# EAGLE schematic Blinky (EAGLE 9.6.2)
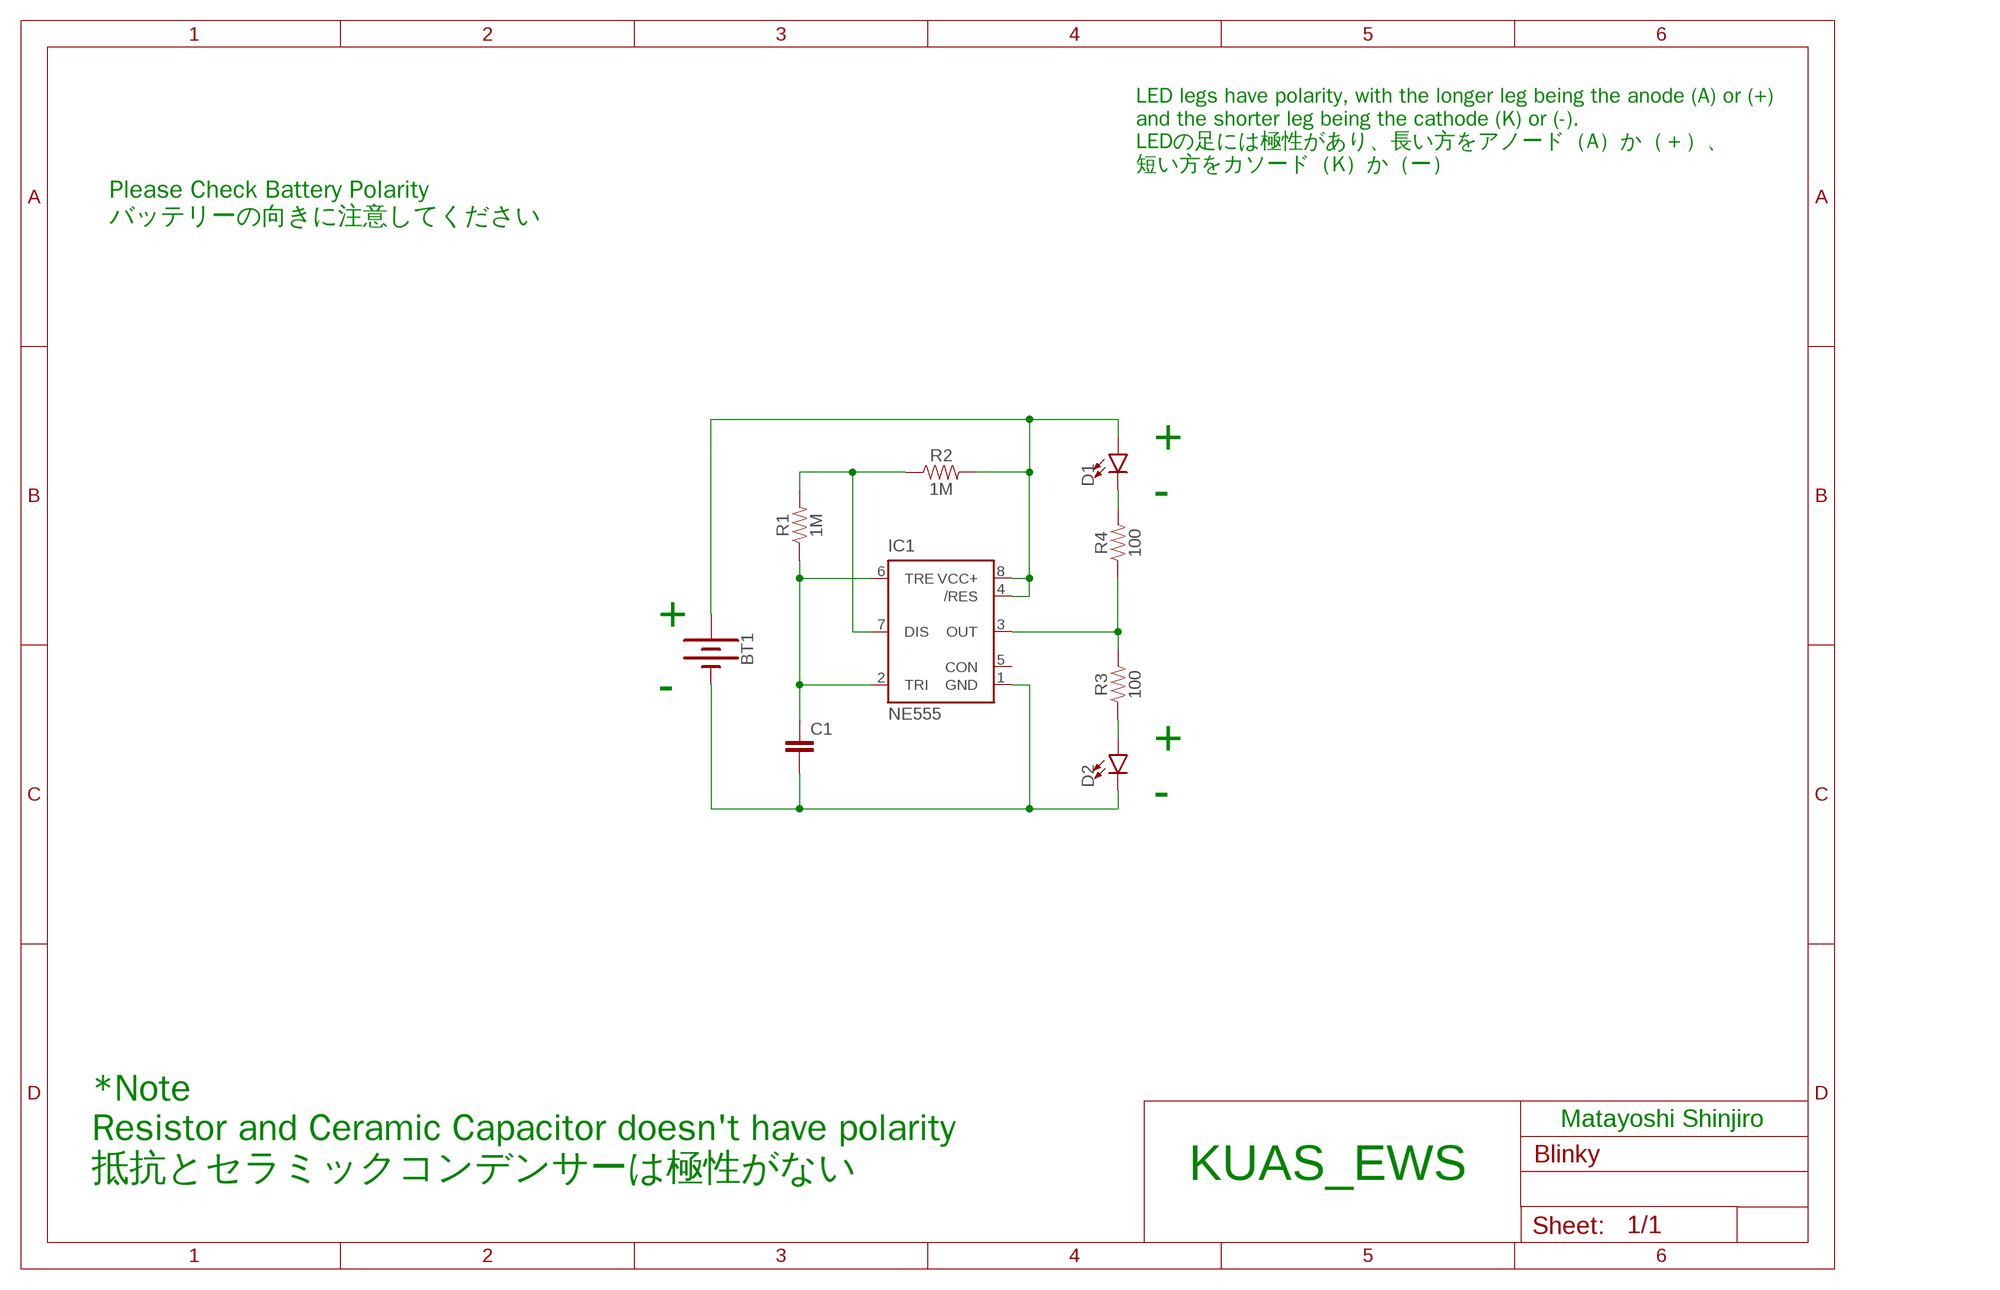
[diagram p0: schematic, sheet 1]

## Parts
BT1  BATTERY-AA  [BATTERY-AA]
C1  C-EU025-025X050  [C025-025X050]
D1  LED5MM-KIT  [LED_5MM-KIT]
D2  LED5MM-KIT  [LED_5MM-KIT]
IC1  NE555  [DIL-08]
R1  1M  1MOHM-HORIZ-1/6W-5%  [AXIAL-0.3]
R2  1M  1MOHM-HORIZ-1/6W-5%  [AXIAL-0.3]
R3  100  1MOHM-HORIZ-1/6W-5%  [AXIAL-0.3]
R4  100  1MOHM-HORIZ-1/6W-5%  [AXIAL-0.3]

## Nets
N$1: BT1.PWR@1(+) D1.A IC1.4(/RES) IC1.8(VCC+) R2.P$2
N$2: IC1.7(DIS) R1.P$2 R2.P$1
N$4: BT1.GND@1(-) C1.2 D2.K(C) IC1.1(GND)
N$5: IC1.3(OUT) R3.P$2 R4.P$1
N$6: D2.A R3.P$1
N$7: D1.K(C) R4.P$2
N$8: C1.1 IC1.2(TRI) IC1.6(TRE) R1.P$1
Unconnected: IC1.5(CON)

## Notes on the sheet
- LED legs have polarity, with the longer leg being the anode (A) or (+) 
  and the shorter leg being the cathode (K) or (-).
  LEDの足には極性があり、長い方をアノード（A）か（＋）、
  短い方をカソード（K）か（ー）
- Please Check Battery Polarity
  バッテリーの向きに注意してください
- +
- -
- +
- -
- +
- -
- Matayoshi Shinjiro
- *Note
  Resistor and Ceramic Capacitor doesn't have polarity
  抵抗とセラミックコンデンサーは極性がない
- KUAS_EWS

## Library data of the parts
BT1 = SparkFun-Batteries:BATTERY: Battery - Single Cell A variety of battery chemistries, sizes, and footprints. Device List: 20MM_PTH - Coin Cell Battery Holder - 20mm (PTH) <https://www.sparkfun.com/products/783> 20MM_PTH_KIT- Coin Cell battery Holder - 20 mm (PTH) <http://www.sparkfun.com/products/783>kit version with special mask 6.8MM_PTH - Coin Cell Battery Holder - 6.8MM(SMD) <https://www.digikey.com/product-detail/en/seiko-instruments/MS621FE-FL11E/728-1057-ND/1889208?WT.srch=1&gclid=CNOQ5a6LzdQCFZS2wAodXCkE0g> 12MM_SMD - Coin Cell Battery Holder - 12mm (SMD) <https://www.sparkfun.com/products/10592> 12MM_PTH - Coin Cell Battery Holder - 12mm (PTH) <https://www.sparkfun.com/products/7948> 20MM_SMD - 20mm Coin Cell Battery Holder (SMD) (2 legs) Used on the Big Time Watch Kit <https://www.sparkfun.com/products/11734> 20MM_SMD_4LEGS - Coin Cell Battery Holder - 20mm (SMD) <https://www.sparkfun.com/products/11892> 20MM_SMD_4LEGS_OVERPASTE - Coin Cell Battery Holder - 20mm (SMD) <https://www.sparkfun.com/products/11892> (Over-paste on the legs) 24.5MM_PTH - Coin Cell Battery Holder - 24.5mm (PTH) <https://www.sparkfun.com/products/8863> 9V - 9V Battery Holder - PC Mount Used on the SparkFun SparkPunk Sound Kit <https://www.sparkfun.com/products/11177> and SparkFun SparkPunk Sequencer Kit <https://www.sparkfun.com/products/12707> 18650 - Battery Holder - 18650 (PTH) <https://www.sparkfun.com/products/13113> AA - Battery Holder - 1xAA (PTH) <https://www.sparkfun.com/products/7949> AAA - Battery Holder - 1xAAA (PTH) <https://www.sparkfun.com/products/12718> AA_KIT - Battery Holder - 1xAA (PTH) <https://www.sparkfun.com/products/7949> Special kit package - pads only have exposed copper on one side of the board. AAA_KIT - Battery Holder - 1xAAA (PTH) <https://www.sparkfun.com/products/12718> Special kit package - pads only have exposed copper on one side of the board.; PROD_ID: BATT-08316; SF_SKU: PRT-07949
C1 = rcl:C-EU: CAPACITOR, European symbol; SPICEPREFIX: C
D1 D2 = SparkFun-LED:LED: LED (Generic) Standard schematic elements and footprints for 5mm, 3mm, 1206, and 0603 sized LEDs. Generic LEDs with no color specified.
IC1 = st-microelectronics:NE555: General purpose bipolar Timer; MF: Arrow Electronics; MPN: NE555N; OC_FARNELL: 1467742; OC_NEWARK: 89K1486
R1 R2 = SparkFun-Resistors:1MOHM: 1MΩ resistor A resistor is a passive two-terminal electrical component that implements electrical resistance as a circuit element. Resistors act to reduce current flow, and, at the same time, act to lower voltage levels within circuits. - Wikipedia; PROD_ID: RES-09559
R3 R4 = SparkFun-Resistors:1MOHM: 1MΩ resistor A resistor is a passive two-terminal electrical component that implements electrical resistance as a circuit element. Resistors act to reduce current flow, and, at the same time, act to lower voltage levels within circuits. - Wikipedia; PROD_ID: RES-09559; VALUE: 1M